# Altium project CATS-Telemetry.PrjPcb
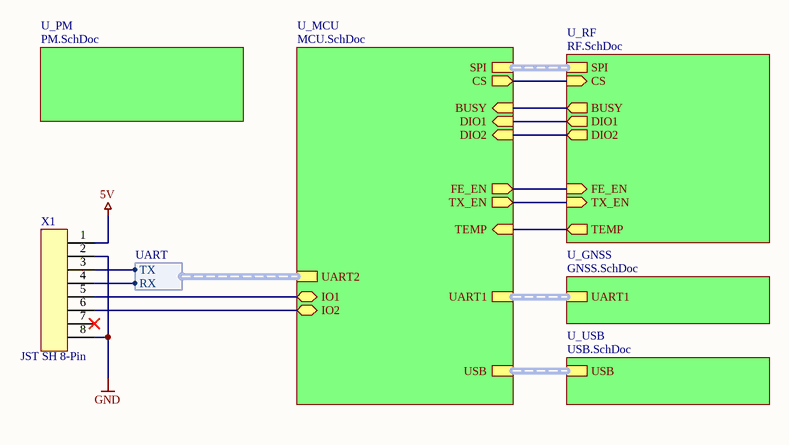
[diagram p0: Overview.SchDoc]
8 sheets, 65 parts. Net scope: hierarchical (ports join the sheet entries above them; power ports are global).
Board file: CATS-Telemetry.PcbDoc
Sheets:
  Overview.SchDoc
    U_MCU = MCU.SchDoc
    U_PM = PM.SchDoc
    U_RF = RF.SchDoc
      U_Frontend = Frontend.SchDoc
      U_Radio = Radio.SchDoc
    U_GNSS = GNSS.SchDoc
    U_USB = USB.SchDoc

## Sheet Overview.SchDoc: CATS Telemetry
size A4; Author: Luca Jost; Revision: 1.0; SheetNumber: 1; SheetTotal: 7; Subtitle: Overview

### Parts
(Parts that share a designator on the sheet are numbered #1, #2 ... from top to bottom, then left to right.)
X1#1  JST SH 8-Pin  [SMD CONNECTOR JST-SR 8 PIN]

### Sub-sheets
U_GNSS = GNSS.SchDoc: UART1 (harness UART)
U_MCU = MCU.SchDoc: SPI (harness SPI), CS (out), FE_EN (out), TX_EN (out), BUSY (in), DIO1 (in), DIO2 (in), TEMP (in), UART1 (harness UART), UART2 (harness UART), IO2 (bidir), IO1 (bidir), USB (harness USB)
U_PM = PM.SchDoc: no entries
U_RF = RF.SchDoc: SPI (harness SPI), CS (in), BUSY (out), DIO1 (out), DIO2 (out), TEMP (out), FE_EN (in), TX_EN (in)
U_USB = USB.SchDoc: USB (harness USB)

### Harnesses
UART: TX, RX

### Nets
5V: X1#1.1
GND: X1#1.2 X1#1.8
NetU1_3: sheet U_MCU/TX_EN, sheet U_RF/TX_EN
NetU2_2: sheet U_MCU/TEMP, sheet U_RF/TEMP
NetU3_1: sheet U_MCU/FE_EN, sheet U_RF/FE_EN
NetU8_7: sheet U_MCU/BUSY, sheet U_RF/BUSY
NetU8_8: sheet U_MCU/DIO1, sheet U_RF/DIO1
NetU8_9: sheet U_MCU/DIO2, sheet U_RF/DIO2
NetU8_19: sheet U_MCU/CS, sheet U_RF/CS
NetX1#1_3: X1#1.3 ; sheet U_MCU/UART2.TX
NetX1#1_4: X1#1.4 ; sheet U_MCU/UART2.RX
NetX1#1_5: X1#1.5 ; sheet U_MCU/IO1
NetX1#1_6: X1#1.6 ; sheet U_MCU/IO2

Not connected (* = marked no-connect by the designer): X1#1 7*

### Buses and harness runs
harness sheet U_GNSS/UART1 = sheet U_MCU/UART1
harness sheet U_MCU/SPI = sheet U_RF/SPI
harness sheet U_MCU/USB = sheet U_USB/USB

### Notes on the sheet
- Title
- Author:
- Subtitle
- Date:
- Rev:
- CATS
- Sheet
- of
- File:

### Library data of the parts
X1#1 = JST SH 8-Pin: Crimp Style Connectors (Wire-to-Board type); Digikey: 455-1808-1-ND

## Sheet MCU.SchDoc: CATS Telemetry
size A4; Author: Luca Jost; Revision: 1.0; SheetNumber: 2; SheetTotal: 7; Subtitle: MCU
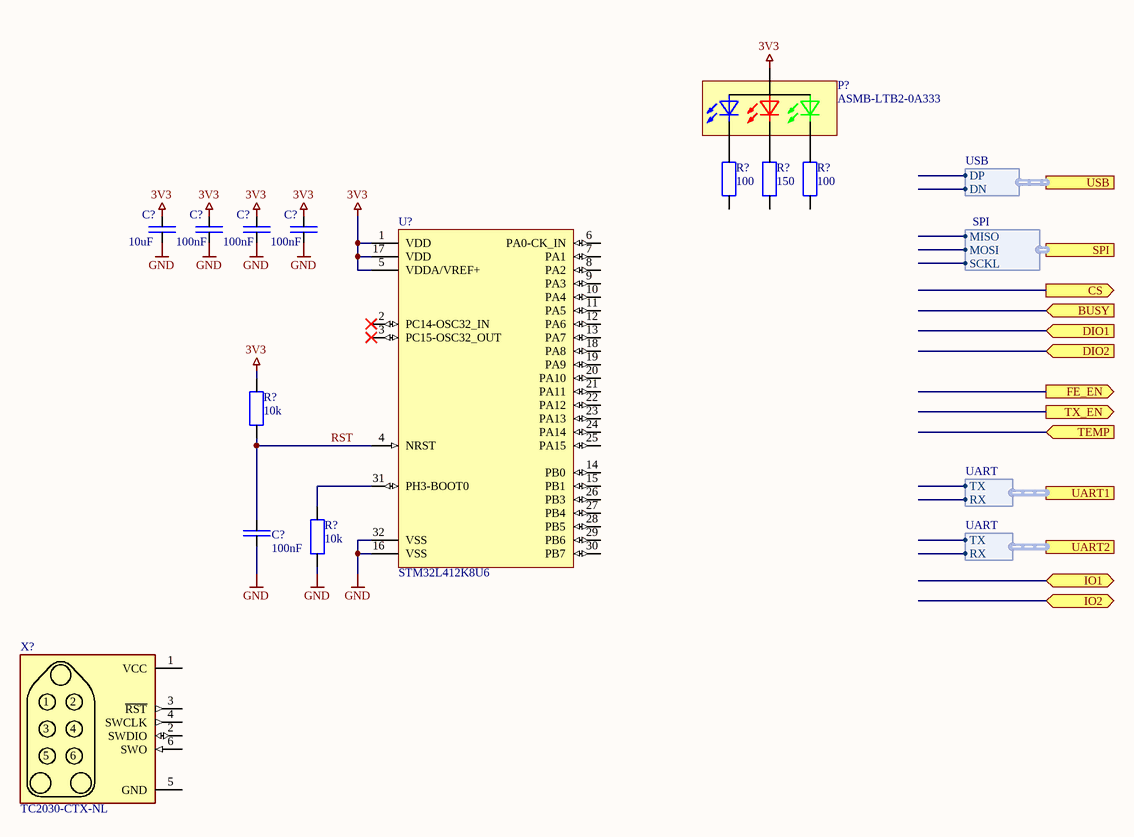
[diagram p1: MCU.SchDoc]

### Parts
(Parts that share a designator on the sheet are numbered #1, #2 ... from top to bottom, then left to right.)
C?#1  10uF  [SMD Keramikkondensator 0603]
C?#2  100nF  [SMD Keramikkondensator 0603]
C?#3  100nF  [SMD Keramikkondensator 0603]
C?#4  100nF  [SMD Keramikkondensator 0603]
C?#5  100nF  [SMD Keramikkondensator 0603]
P?  ASMB-LTB2-0A333  [SMD LED PLCC-4]
R?#1  100  [SMD Widerstand 0805]
R?#2  150  [SMD Widerstand 0805]
R?#3  100  [SMD Widerstand 0805]
R?#4  10k  [SMD Widerstand 0603]
R?#5  10k  [SMD Widerstand 0603]
U?  STM32L412K8U6  [SMD IC QFN-32]
X?#1  TC2030-CTX-NL  [SMD Connector TC2030 w/ holes]  (no BOM)

### Ports
BUSY (in), CS (out), DIO1 (in), DIO2 (in), FE_EN (out), IO1 (bidir), IO2 (bidir), SPI (harness SPI), TEMP (in), TX_EN (out), UART1 (harness UART), UART2 (harness UART), USB (harness USB)

### Harnesses
USB: DP, DN
SPI: SCKL, MOSI, MISO
UART: TX, RX

### Nets
3V3: C?#1.2 C?#2.2 C?#3.2 C?#4.2 P?.1 R?#4.2 U?.1(VDD) U?.5(VDDA/VREF+) U?.17(VDD)
GND: C?#1.1 C?#2.1 C?#3.1 C?#4.1 C?#5.1 R?#5.2 U?.16(VSS) U?.32(VSS)
RST: C?#5.2 R?#4.1 U?.4(NRST)
NetP?_2: P?.2 R?#2.2
NetP?_3: P?.3 R?#3.2
NetP?_4: P?.4 R?#1.2
NetR?#5_1: R?#5.1 U?.31(PH3-BOOT0)

Not connected (* = marked no-connect by the designer): R?#1 1; R?#2 1; R?#3 1; U? 2(PC14-OSC32_IN)* 3(PC15-OSC32_OUT)* 6(PA0-CK_IN) 7(PA1) 8(PA2) 9(PA3) 10(PA4) 11(PA5) 12(PA6) 13(PA7) 14(PB0) 15(PB1) 18(PA8) 19(PA9) 20(PA10) 21(PA11) 22(PA12) 23(PA13) 24(PA14) 25(PA15) 26(PB3) 27(PB4) 28(PB5) 29(PB6) 30(PB7); X?#1 1(VCC) 2(SWDIO) 3(~{RST}) 4(SWCLK) 5(GND) 6(SWO)

### Notes on the sheet
- Title
- Author:
- Subtitle
- Date:
- Rev:
- CATS
- Sheet
- of
- File:

### Library data of the parts
C?#1 = E6 - 10uF: SMD Ceramic Capacitor E6; Unit Price: 0.01; Number: -; Supplier: -
C?#2-C?#5 = E6 - 100nF: SMD Ceramic Capacitor E6; Unit Price: 0.01; Number: -; Supplier: -
P? = ASMB-LTB2-0A333: Red, Green, Blue (RGB) 621nm Red, 522nm Green, 468nm Blue LED Indication - Discrete 2.1V Red, 2.9V Green, 2.9V Blue 4-SMD, J-Lead; ComponentLink1Description: Datasheet; ComponentLink1URL: https://docs.broadcom.com/doc/ASMB-LTB2-0A333-2121-Tricolor-PLCC-4-LED-DS
R?#1 R?#3 = E24 - 100: SMD Chip Resistor E24; Unit Price: 0.01; Number: -; Supplier: -
R?#2 = E24 - 150: SMD Chip Resistor E24; Unit Price: 0.01; Number: -; Supplier: -
R?#4 R?#5 = E24 - 10k: SMD Chip Resistor E24; Unit Price: 0.01; Number: -; Supplier: -
U? = STM32L412K8U6: Ultra-low-power with FPU Arm Cortex-M4 MCU 80 MHz with 64 Kbytes of Flash memory, USB; ComponentLink1Description: Datasheet; ComponentLink1URL: https://www.st.com/resource/en/datasheet/stm32l412c8.pdf; Digikey: 497-STM32L412K8U6-ND
X?#1 = TC2030-CTX-NL: Tag-Connect for ARM-Cortex (6-Pin)

## Sheet PM.SchDoc: CATS Telemetry
size A4; Author: Luca Jost; Revision: 1.0; SheetNumber: 3; SheetTotal: 7; Subtitle: Power Management
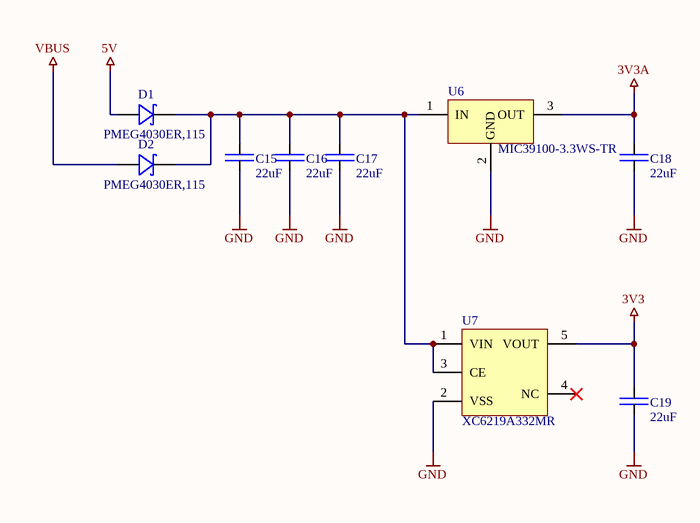
[diagram p2: PM.SchDoc]

### Parts
C15  22uF  [SMD Keramikkondensator 0805]
C16  22uF  [SMD Keramikkondensator 0805]
C17  22uF  [SMD Keramikkondensator 0805]
C18  22uF  [SMD Keramikkondensator 0805]
C19  22uF  [SMD Keramikkondensator 0805]
D1  PMEG4030ER,115  [SMD Diode SOD-123]
D2  PMEG4030ER,115  [SMD Diode SOD-123]
U6  MIC39100-3.3WS-TR  [SMD IC SOT-223-3]
U7  XC6219A332MR  [SMD IC SOT-23-5]

### Nets
3V3: C19.2 U7.5(VOUT)
3V3A: C18.2 U6.3(OUT)
5V: D1.A
GND: C15.1 C16.1 C17.1 C18.1 C19.1 U6.2(GND) U7.2(VSS)
VBUS: D2.A
NetC15_2: C15.2 C16.2 C17.2 D1.K D2.K U6.1(IN) U7.1(VIN) U7.3(CE)

Not connected (* = marked no-connect by the designer): U7 4(NC)*

### Notes on the sheet
- Title
- Author:
- Subtitle
- Date:
- Rev:
- CATS
- Sheet
- of
- File:

### Library data of the parts
C15-C19 = E6 - 22uF: SMD Ceramic Capacitor E6; Unit Price: 0.01; Number: -; Supplier: -
D1 D2 = PMEG4030ER,115: Diode Schottky 3A Surface Mount CFP3; Digikey: 1727-5313-2-ND
U6 = MIC39100-3.3WS-TR: Linear Voltage Regulator IC Positive Fixed 1 Output 1A SOT-223-3; ComponentLink1Description: Datasheet; ComponentLink1URL: https://ww1.microchip.com/downloads/en/DeviceDoc/20005834A.pdf; Digikey: MIC39100-3.3WS-TR-ND
U7 = XC6219A332MR: 300mA High Speed LDO Regulators with ON/OFF Switch; Digikey: 893-1167-1-ND; ComponentLink1Description: Datasheet; ComponentLink1URL: https://datasheet.lcsc.com/szlcsc/1809201520_Torex-Semicon-XC6219A332MR_C58229.pdf

## Sheet RF.SchDoc: CATS Telemetry
size A4; Author: Luca Jost; Revision: 1.0; SheetNumber: 4; SheetTotal: 7; Subtitle: RF
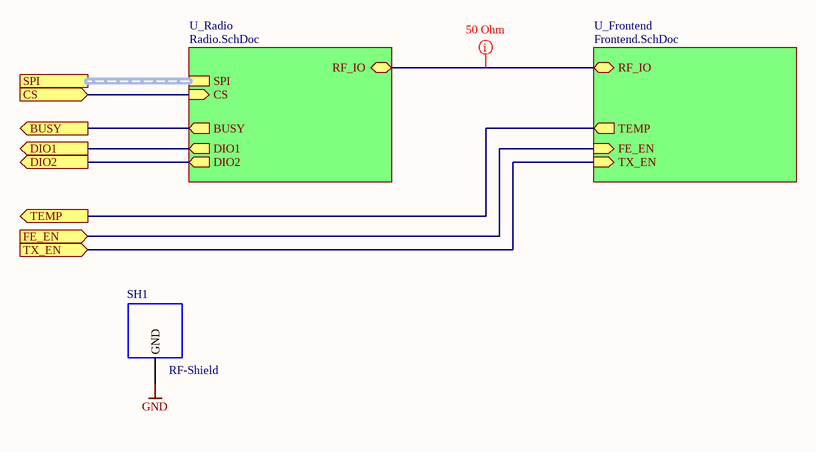
[diagram p3: RF.SchDoc]

### Parts
SH1  RF-Shield  [SMD Shield 36903205S]

### Sub-sheets
U_Frontend = Frontend.SchDoc: FE_EN (in), TX_EN (in), TEMP (out), RF_IO (bidir)
U_Radio = Radio.SchDoc: SPI (harness SPI), CS (in), BUSY (out), DIO1 (out), DIO2 (out), RF_IO (bidir)

### Ports
BUSY (out), CS (in), DIO1 (out), DIO2 (out), FE_EN (in), SPI (harness SPI), TEMP (out), TX_EN (in)

### Nets
GND: SH1.0(GND)
NetC21_2: sheet U_Frontend/RF_IO, sheet U_Radio/RF_IO
NetU1_3: port TX_EN, sheet U_Frontend/TX_EN
NetU2_2: port TEMP, sheet U_Frontend/TEMP
NetU3_1: port FE_EN, sheet U_Frontend/FE_EN
NetU8_7: port BUSY, sheet U_Radio/BUSY
NetU8_8: port DIO1, sheet U_Radio/DIO1
NetU8_9: port DIO2, sheet U_Radio/DIO2
NetU8_19: port CS, sheet U_Radio/CS

### Buses and harness runs
harness port SPI = sheet U_Radio/SPI

### Layout directives
rule Impedance Constraint [Min = 50.00    Max = 50.00    ]: NetC21_2

### Notes on the sheet
- Title
- Author:
- Subtitle
- Date:
- Rev:
- CATS
- Sheet
- of
- File:

### Library data of the parts
SH1 = RF-Shield 20x20mm: RF Shield Cover 0.787" (20.00mm) X 0.787" (20.00mm) Non-Vented Snap Fit

## Sheet Frontend.SchDoc: CATS Telemetry
size A4; Author: Luca Jost; Revision: 1.0; SheetNumber: 6; SheetTotal: 7; Subtitle: Front End
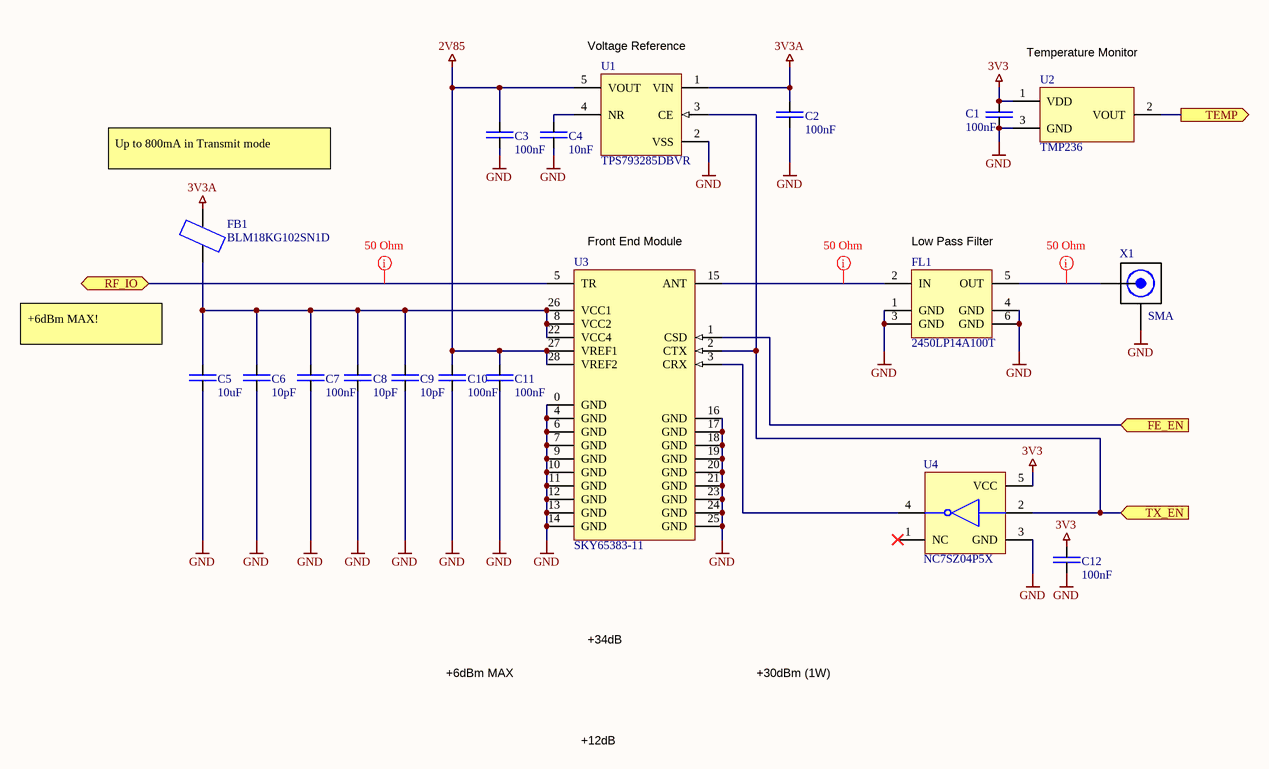
[diagram p4: Frontend.SchDoc]

### Parts
(Parts that share a designator on the sheet are numbered #1, #2 ... from top to bottom, then left to right.)
C1  100nF  [SMD Keramikkondensator 0603]
C2  100nF  [SMD Keramikkondensator 0603]
C3  100nF  [SMD Keramikkondensator 0603]
C4  10nF  [SMD Keramikkondensator 0603]
C5  10uF  [SMD Keramikkondensator 0603]
C6  10pF  [SMD Keramikkondensator 0603]
C7  100nF  [SMD Keramikkondensator 0603]
C8  10pF  [SMD Keramikkondensator 0603]
C9  10pF  [SMD Keramikkondensator 0603]
C10  100nF  [SMD Keramikkondensator 0603]
C11  100nF  [SMD Keramikkondensator 0603]
C12  100nF  [SMD Keramikkondensator 0603]
FB1  BLM18KG102SN1D  [SMD Ferrite Bead 0603]
FL1  2450LP14A100T  [SMD Filter 2450LP14A100T]
U1  TPS793285DBVR  [SMD IC SOT-23-5]
U2  TMP236  [SMD IC SOT-23]
U3  SKY65383-11  [SMD IC 28-MCM]
U4  NC7SZ04P5X  [SMD IC SOT-353 (SC-70-5)]
X1#2  SMA  [THT Buchse SMA Female]

### Ports
FE_EN (in), RF_IO (bidir), TEMP (out), TX_EN (in)

### Nets
2V85: C3.2 C10.2 C11.2 U1.5(VOUT) U3.27(VREF1) U3.28(VREF2)
3V3: C1.2 C12.2 U2.1(VDD) U4.5(VCC)
3V3A: C2.2 FB1.2 U1.1(VIN)
GND: C1.1 C2.1 C3.1 C4.1 C5.1 C6.1 C7.1 C8.1 C9.1 C10.1 C11.1 C12.1 FL1.1(GND) FL1.3(GND) FL1.4(GND) FL1.6(GND) U1.2(VSS) U2.3(GND) U3.0(GND) U3.4(GND) U3.6(GND) U3.7(GND) U3.9(GND) U3.10(GND) U3.11(GND) U3.12(GND) U3.13(GND) U3.14(GND) U3.16(GND) U3.17(GND) U3.18(GND) U3.19(GND) U3.20(GND) U3.21(GND) U3.23(GND) U3.24(GND) U3.25(GND) U4.3(GND) X1#2.2(RF)
NetC4_2: C4.2 U1.4(NR)
NetC5_2: C5.2 C6.2 C7.2 C8.2 C9.2 FB1.1 U3.8(VCC2) U3.22(VCC4) U3.26(VCC1)
NetC21_2: U3.5(TR) ; port RF_IO
NetFL1_2: FL1.2(IN) U3.15(ANT)
NetFL1_5: FL1.5(OUT) X1#2.1(RF)
NetU1_3: U1.3(CE) U3.2(CTX) U4.2(A) ; port TX_EN
NetU2_2: U2.2(VOUT) ; port TEMP
NetU3_1: U3.1(CSD) ; port FE_EN
NetU3_3: U3.3(CRX) U4.4(Y)

Not connected (* = marked no-connect by the designer): U4 1(NC)*

### Layout directives
rule Impedance Constraint [Min = 50.00    Max = 50.00    ]; net class RF-Line 50: NetC21_2, NetFL1_2, NetFL1_5

### Notes on the sheet
- (near U1) Voltage Reference
- Temperature Monitor
- Up to 800mA in Transmit mode
- (near U3) Front End Module
- (near FL1) Low Pass Filter
- +6dBm MAX!
- +6dBm MAX
- +34dB
- +30dBm (1W)
- +12dB
- Title
- Author:
- Subtitle
- Date:
- Rev:
- CATS
- Sheet
- of
- File:

### Library data of the parts
C1-C3 C7 C10-C12 = E6 - 100nF: SMD Ceramic Capacitor E6; Unit Price: 0.01; Number: -; Supplier: -
C4 = E6 - 10nF: SMD Ceramic Capacitor E6; Unit Price: 0.01; Number: -; Supplier: -
C5 = E6 - 10uF: SMD Ceramic Capacitor E6; Unit Price: 0.01; Number: -; Supplier: -
C6 C8 C9 = E6 - 10pF: SMD Ceramic Capacitor E6; Unit Price: 0.01; Number: -; Supplier: -
FB1 = BLM18KG102SN1D: 1 kOhms @ 100MHz 1 Power Line Ferrite Bead 0603 (1608 Metric) 1A 200mOhm; ComponentLink1Description: Datasheet; ComponentLink1URL: https://www.murata.com/en-us/products/productdata/8796738650142/ENFA0003.pdf; Digikey: 490-17349-1-ND
FL1 = 2450LP14A100T: 2.45GHz Center Frequency Low Pass RF Filter (Radio Frequency) 100MHz Bandwidth 0.5dB 0603 (1608 Metric), 6 PC Pad; ComponentLink1Description: Datasheet; ComponentLink1URL: https://www.johansontechnology.com/datasheets/2450LP14A100/2450LP14A100.pdf; Digikey: 712-1129-2-ND
U1 = TPS793285DBVR: Linear Voltage Regulator IC Positive Fixed 1 Output  200mA SOT-23-5 2.85V; ComponentLink1Description: Datasheet; ComponentLink1URL: https://media.digikey.com/pdf/Data%20Sheets/Texas%20Instruments%20PDFs/TPS793_Rev2015.pdf; Digikey: 296-12157-1-ND
U2 = TMP236: Low-Power, High-Accuracy Analog Output Temperature Sensors; ComponentLink1Description: Datasheet; ComponentLink1URL: https://www.ti.com/lit/ds/symlink/tmp236.pdf?HQS=dis-dk-null-digikeymode-dsf-pf-null-wwe&ts=1624574807670&ref_url=https%253A%252F%252Fwww.digikey.ch%252F; Digikey: 296-TMP236A4DBZRCT-ND
U3 = SKY65383-11: 2400 to 2483 MHz Transmit/Receive / Front-End Module +30dBm; ComponentLink1Description: Datasheet; ComponentLink1URL: https://www.skyworksinc.com/-/media/SkyWorks/Documents/Products/2901-3000/SKY65383-11_202668G.pdf; Digikey: 863-1798-1-ND
U4 = NC7SZ04P5X: Inverter IC 1 Channel  SC-70-5; ComponentLink1Description: Datasheet; ComponentLink1URL: https://rocelec.widen.net/view/pdf/vg5irfcitj/ONSM-S-A0003590433-1.pdf?t.download=true&u=5oefqw
X1#2 = SMA Connector: Female SMA Connector THT; Digikey: 931-1361-ND

## Sheet Radio.SchDoc: CATS Telemetry
size A4; Author: Luca Jost; Revision: 1.0; SheetNumber: 5; SheetTotal: 7; Subtitle: Radio
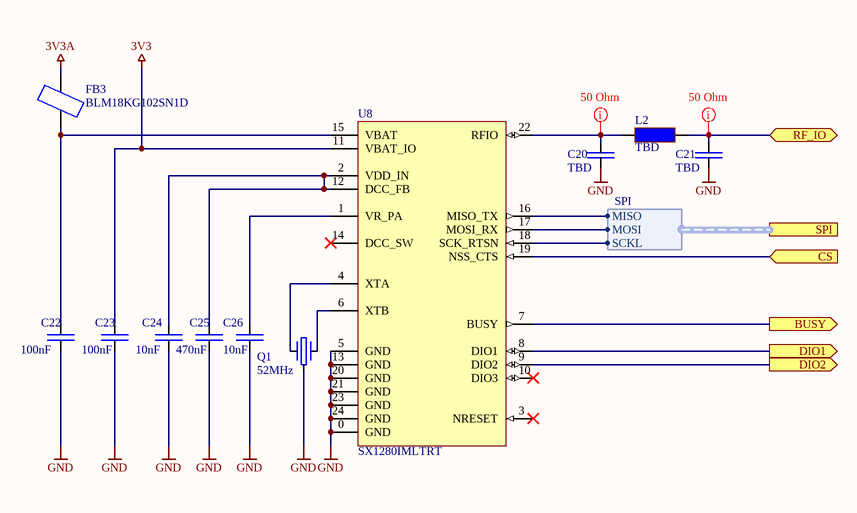
[diagram p5: Radio.SchDoc]

### Parts
C20  TBD  [SMD Keramikkondensator 0402]
C21  TBD  [SMD Keramikkondensator 0402]
C22  100nF  [SMD Keramikkondensator 0603]
C23  100nF  [SMD Keramikkondensator 0603]
C24  10nF  [SMD Keramikkondensator 0603]
C25  470nF  [SMD Keramikkondensator 0603]
C26  10nF  [SMD Keramikkondensator 0603]
FB3  BLM18KG102SN1D  [SMD Ferrite Bead 0603]
L2  TBD  [SMD Ferrite Bead 0402]
Q1  52MHz  [SMD Crystal 3.2X2.5X0.8]
U8  SX1280IMLTRT  [SMD IC QFN-24]

### Ports
BUSY (out), CS (in), DIO1 (out), DIO2 (out), RF_IO (bidir), SPI (harness SPI)

### Harnesses
SPI: SCKL, MOSI, MISO

### Nets
3V3: C23.2 U8.11(VBAT_IO)
3V3A: FB3.2
GND: C20.1 C21.1 C22.1 C23.1 C24.1 C25.1 C26.1 Q1.3 U8.0(GND) U8.5(GND) U8.13(GND) U8.20(GND) U8.21(GND) U8.23(GND) U8.24(GND)
NetC20_2: C20.2 L2.1 U8.22(RFIO)
NetC21_2: C21.2 L2.2 ; port RF_IO
NetC22_2: C22.2 FB3.1 U8.15(VBAT)
NetC24_2: C24.2 C25.2 U8.2(VDD_IN) U8.12(DCC_FB)
NetC26_2: C26.2 U8.1(VR_PA)
NetQ1_1: Q1.1 U8.4(XTA)
NetQ1_2: Q1.2 U8.6(XTB)
NetU8_7: U8.7(BUSY) ; port BUSY
NetU8_8: U8.8(DIO1) ; port DIO1
NetU8_9: U8.9(DIO2) ; port DIO2
NetU8_16: U8.16(MISO_TX) ; port SPI.MISO
NetU8_17: U8.17(MOSI_RX) ; port SPI.MOSI
NetU8_18: U8.18(SCK_RTSN) ; port SPI.SCKL
NetU8_19: U8.19(NSS_CTS) ; port CS

Not connected (* = marked no-connect by the designer): U8 3(NRESET)* 10(DIO3)* 14(DCC_SW)*

### Layout directives
rule Impedance Constraint [Min = 50.00    Max = 50.00    ]; net class RF-Line 50: NetC20_2, NetC21_2

### Notes on the sheet
- Title
- Author:
- Subtitle
- Date:
- Rev:
- CATS
- Sheet
- of
- File:

### Library data of the parts
C20 C21 = E6 - 10pF: SMD Ceramic Capacitor E6; Unit Price: 0.01; Number: -; Supplier: -
C22 C23 = E6 - 100nF: SMD Ceramic Capacitor E6; Unit Price: 0.01; Number: -; Supplier: -
C24 C26 = E6 - 10nF: SMD Ceramic Capacitor E6; Unit Price: 0.01; Number: -; Supplier: -
C25 = E6 - 470nF: SMD Ceramic Capacitor E6; Unit Price: 0.01; Number: -; Supplier: -
FB3 = BLM18KG102SN1D: as FB1 on sheet Frontend; ComponentLink1Description: Datasheet; ComponentLink1URL: https://www.murata.com/en-us/products/productdata/8796738650142/ENFA0003.pdf; Digikey: 490-17349-1-ND
L2 = Inductor Pi-Matching: Pi-Matchng Inductor
Q1 = Crystal 52MHz - FL520WFMT1: 52MHz ±7ppm Crystal 12pF 30 Ohms 4-SMD, No Lead; ComponentLink1Description: Datasheet; ComponentLink1URL: https://www.diodes.com/assets/Datasheets/FL.pdf
U8 = SX1280IMLTRT: Long Range, Low Power, 2.4 GHz / Transceiver with Ranging Capability; ComponentLink1Description: Datasheet; ComponentLink1URL: https://media.digikey.com/pdf/Data%20Sheets/Semtech%20PDFs/SX1280-81_Rev3.2_Mar2020.pdf; Digikey: SX1280IMLTRTCT-ND

## Sheet GNSS.SchDoc: CATS Telemetry
size A4; Author: Luca Jost; Revision: 1.0; SheetNumber: 7; SheetTotal: 7; Subtitle: GNSS
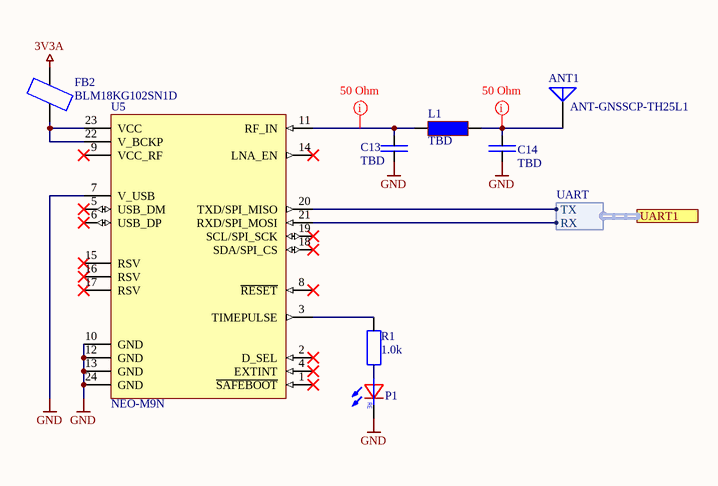
[diagram p6: GNSS.SchDoc]

### Parts
ANT1  ANT-GNSSCP-TH25L1  [THT Antenna ANT-GNSSCP-TH25L1]
C13  TBD  [SMD Keramikkondensator 0402]
C14  TBD  [SMD Keramikkondensator 0402]
FB2  BLM18KG102SN1D  [SMD Ferrite Bead 0603]
L1  TBD  [SMD Ferrite Bead 0402]
P1  LED  [SMD LED 0603]  (value not drawn)
R1  1.0k  [SMD Widerstand 0603]
U5  NEO-M9N  [SMD NEO]

### Ports
UART1 (harness UART)

### Harnesses
UART: TX, RX

### Nets
3V3A: FB2.2
GND: C13.1 C14.1 P1.K U5.7(V_USB) U5.10(GND) U5.12(GND) U5.13(GND) U5.24(GND)
NetANT1_1: ANT1.1 C14.2 L1.2
NetC13_2: C13.2 L1.1 U5.11(RF_IN)
NetFB2_1: FB2.1 U5.22(V_BCKP) U5.23(VCC)
NetP1_A: P1.A R1.1
NetR1_2: R1.2 U5.3(TIMEPULSE)
NetU5_20: U5.20(TXD/SPI_MISO) ; port UART1.TX
NetU5_21: U5.21(RXD/SPI_MOSI) ; port UART1.RX

Not connected (* = marked no-connect by the designer): U5 1(~{SAFEBOOT})* 2(D_SEL)* 4(EXTINT)* 5(USB_DM)* 6(USB_DP)* 8(~{RESET})* 9(VCC_RF)* 14(LNA_EN)* 15(RSV)* 16(RSV)* 17(RSV)* 18(SDA/SPI_CS)* 19(SCL/SPI_SCK)*

### Layout directives
rule Impedance Constraint [Min = 50.00    Max = 50.00    ]; net class RF-Line 50: NetANT1_1, NetC13_2

### Notes on the sheet
- Title
- Author:
- Subtitle
- Date:
- Rev:
- CATS
- Sheet
- of
- File:
- (in symbol LED) RE

### Library data of the parts
ANT1 = ANT-GNSSCP-TH25L1: 1.575GHz, 1.602GHz Beidou, Galileo, GLONASS, GNSS, GPS Ceramic Patch RF Antenna 1.567GHz ~ 1.609GHz 3.5dBi, 4dBi, 4dBi Pin Adhesive; ComponentLink1Description: Datasheet; ComponentLink1URL: https://linxtechnologies.com/wp/wp-content/uploads/ant-gnsscp-th25l1-ds.pdf
C13 C14 = E6 - 10pF: SMD Ceramic Capacitor E6; Unit Price: 0.01; Number: -; Supplier: -
FB2 = BLM18KG102SN1D: as FB1 on sheet Frontend; ComponentLink1Description: Datasheet; ComponentLink1URL: https://www.murata.com/en-us/products/productdata/8796738650142/ENFA0003.pdf; Digikey: 490-17349-1-ND
L1 = Inductor Pi-Matching: Pi-Matchng Inductor
P1 = LED: Color LED
R1 = E24 - 1.0k: SMD Chip Resistor E24; Unit Price: 0.01; Number: -; Supplier: -
U5 = NEO-M9N: u-blox M9 standard precision module; ComponentLink1Description: Datasheet; ComponentLink1URL: https://www.u-blox.com/sites/default/files/NEO-M9N_Integrationmanual_%28UBX-19014286%29.pdf; Digikey: 672-NEO-M9N-00BTR-ND

## Sheet USB.SchDoc: CATS Telemetry
size A4; Author: Luca Jost; Revision: 1.0; SheetNumber: 1; SheetTotal: 1; Subtitle: USB
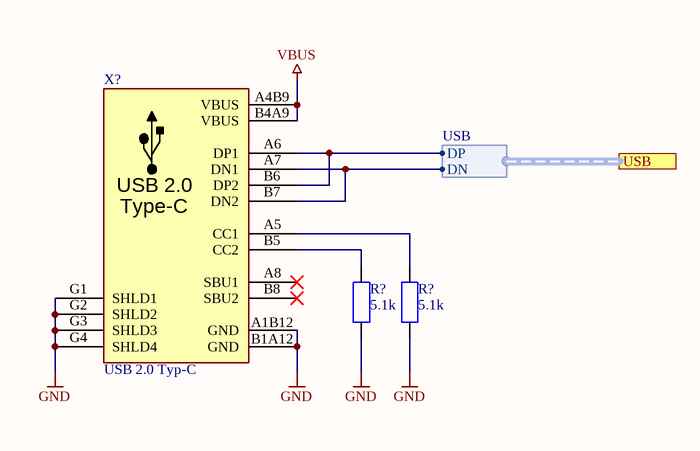
[diagram p7: USB.SchDoc]

### Parts
(Parts that share a designator on the sheet are numbered #1, #2 ... from top to bottom, then left to right.)
R?#6  5.1k  [SMD Widerstand 0603]
R?#7  5.1k  [SMD Widerstand 0603]
X?#2  USB 2.0 Typ-C  [THT USB-C Socket (A40-00119)]

### Ports
USB (harness USB)

### Harnesses
USB: DP, DN

### Nets
GND: R?#6.1 R?#7.1 X?#2.A1B12(GND) X?#2.B1A12(GND) X?#2.G1(SHLD1) X?#2.G2(SHLD2) X?#2.G3(SHLD3) X?#2.G4(SHLD4)
VBUS: X?#2.A4B9(VBUS) X?#2.B4A9(VBUS)
NetR?#6_2: R?#6.2 X?#2.B5(CC2)
NetR?#7_2: R?#7.2 X?#2.A5(CC1)
NetX?#2_A6: X?#2.A6(DP1) X?#2.B6(DP2) ; port USB.DP
NetX?#2_A7: X?#2.A7(DN1) X?#2.B7(DN2) ; port USB.DN

Not connected (* = marked no-connect by the designer): X?#2 A8(SBU1)* B8(SBU2)*

### Notes on the sheet
- Title
- Author:
- Subtitle
- Date:
- Rev:
- CATS
- Sheet
- of
- File:
- (in symbol USB Type-C USB 2.0) USB 2.0; Type-C

### Library data of the parts
R?#6 R?#7 = E24 - 5.1k: SMD Chip Resistor E24; Unit Price: 0.01; Number: -; Supplier: -
X?#2 = USB Type-C USB 2.0: Typ-C; aliExpress: 33045191307; Digikey: 2073-USB4105-GF-ACT-ND; Farnell: 3583366

## Nets that join several sheets
3V3: MCU (9 pins), PM (C19.2 U7.5), Frontend (C1.2 C12.2 U2.1 U4.5), Radio (C23.2 U8.11)
3V3A: PM (C18.2 U6.3), Frontend (C2.2 FB1.2 U1.1), Radio (FB3.2), GNSS (FB2.2)
5V: Overview (X1#1.1), PM (D1.A)
GND: Overview (X1#1.2 X1#1.8), MCU (8 pins), PM (7 pins), RF (SH1.0), Frontend (39 pins), Radio (15 pins), GNSS (8 pins), USB (8 pins)
VBUS: PM (D2.A), USB (X?#2.A4B9 X?#2.B4A9)
NetC21_2: Frontend (U3.5), Radio (C21.2 L2.2)